# EAGLE design schema (EAGLE 9.5.1)
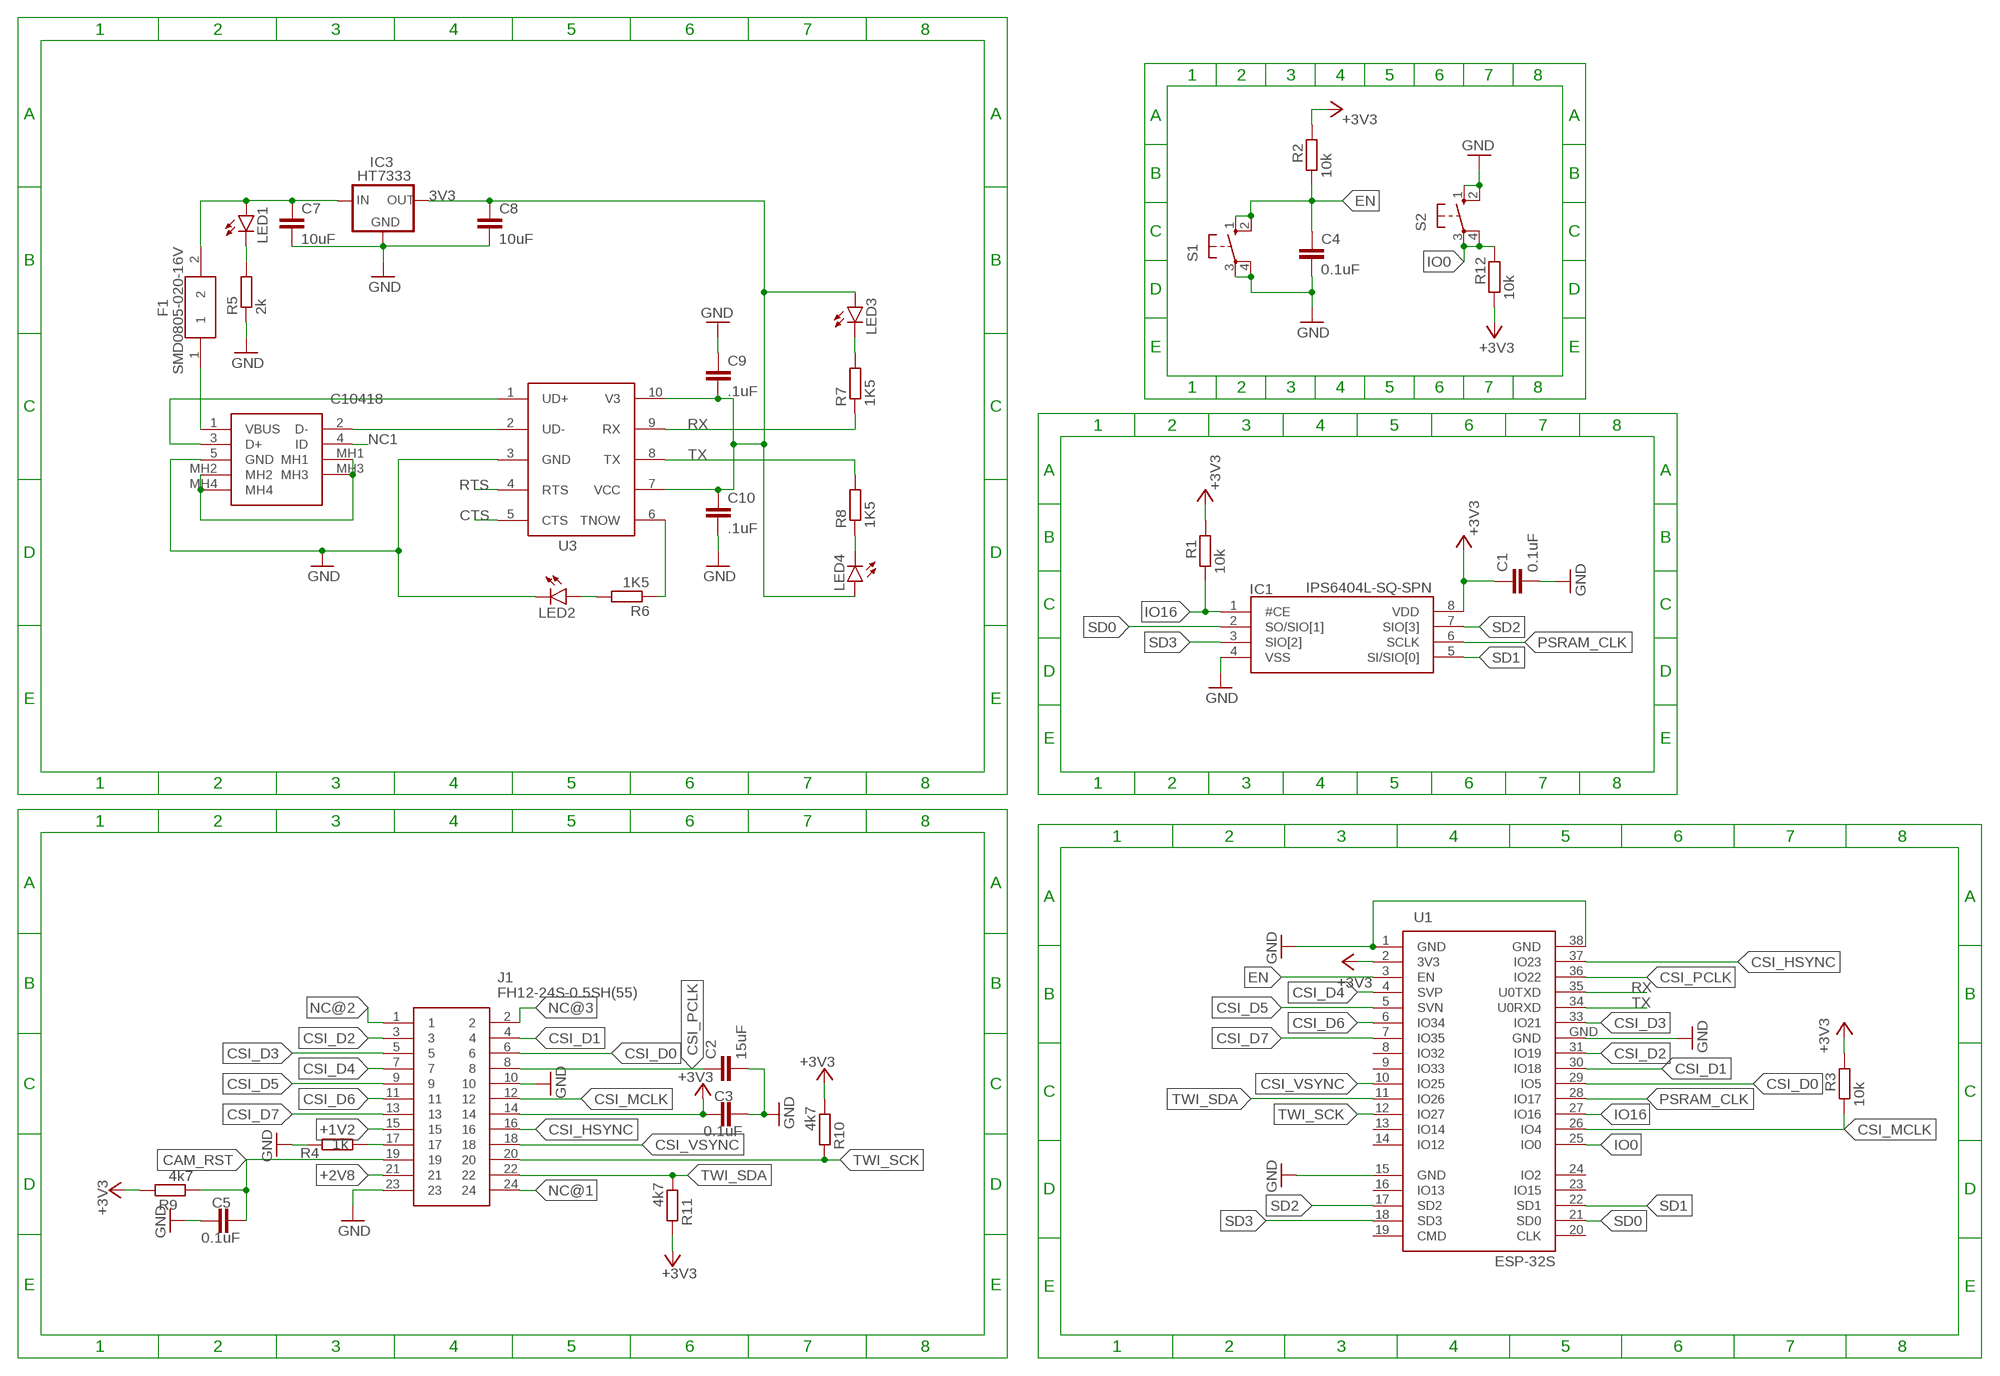
[diagram p0: schematic, sheet 1]

## Parts
C1  0.1uF  C-EUC0805  [C0805]
C2  15uF  C-EUC0805  [C0805]
C3  0.1uF  C-EUC0805  [C0805]
C4  0.1uF  C-EUC0805  [C0805]
C5  0.1uF  C-EUC0805  [C0805]
C7  10uF  C-EUC0805  [C0805]
C8  10uF  C-EUC0805  [C0805]
C9  .1uF  C-EUC0805  [C0805]
C10  .1uF  C-EUC0805  [C0805]
F1  SMD0805-020-16V  [FUSC2114X100N]
IC1  IPS6404L-SQ-SPN  [SOIC127P600X175-8N]
IC3  HT7333  [SOT-89]
J1  FH12-24S-0.5SH(55)  [FH12-24S-0.5SH(55)]
J3  C10418  [C10418]
LED1  LEDCHIP-LED0805  [CHIP-LED0805]
LED2  LEDCHIP-LED0805  [CHIP-LED0805]
LED3  LEDCHIP-LED0805  [CHIP-LED0805]
LED4  LEDCHIP-LED0805  [CHIP-LED0805]
R1  10k  R-EU_R0805  [R0805]
R2  10k  R-EU_R0805  [R0805]
R3  10k  R-EU_R0805  [R0805]
R4  1k  R-EU_R0805  [R0805]
R5  2k  R-EU_R0805  [R0805]
R6  1K5  R-EU_R0805  [R0805]
R7  1K5  R-EU_R0805  [R0805]
R8  1K5  R-EU_R0805  [R0805]
R9  4k7  R-EU_R0805  [R0805]
R10  4k7  R-EU_R0805  [R0805]
R11  4k7  R-EU_R0805  [R0805]
R12  10k  R-EU_R0805  [R0805]
S1  10-XX  [B3F-10XX]
S2  10-XX  [B3F-10XX]
U1  ESP-32S  [ESP-32S]
U3  CH340ESMD  [MSOP10]

## Nets
3V3: C8.1 C9.2 C10.1 IC3.1(OUT) LED3.A LED4.A U3.7(VCC) U3.10(V3)
5V-USB: F1.1 J3.1(VBUS)
+1V2: J1.15
+2V8: J1.21
+3V3: C1.1 C3.1 IC1.8(VDD) J1.14 R1.2 R2.2 R3.2 R9.2 R10.1 R11.2 R12.1 U1.2(3V3)
+5V1: C7.1 F1.2 IC3.3(IN) IC3.4(IN) LED1.A
CAM_RST: C5.2 J1.19 R9.1
CSI_D0: J1.6 U1.29(IO5)
CSI_D1: J1.4 U1.30(IO18)
CSI_D2: J1.3 U1.31(IO19)
CSI_D3: J1.5 U1.33(IO21)
CSI_D4: J1.7 U1.4(SVP)
CSI_D5: J1.9 U1.5(SVN)
CSI_D6: J1.11 U1.6(IO34)
CSI_D7: J1.13 U1.7(IO35)
CSI_HSYNC: J1.16 U1.37(IO23)
CSI_MCLK: J1.12 R3.1 U1.26(IO4)
CSI_PCLK: C2.1 J1.8 U1.36(IO22)
CSI_VSYNC: J1.18 U1.10(IO25)
CTS: U3.5(CTS)
D+1: J3.3(D+) U3.1(UD+)
D-1: J3.2(D-) U3.2(UD-)
EN: C4.1 R2.1 S1.1(S) S1.2(S1) U1.3(EN)
GND: C1.2 C2.2 C3.2 C4.2 C5.1 C7.2 C8.2 C9.1 C10.2 IC1.4(VSS) IC3.2(GND) J1.10 J1.23 J3.5(GND) LED2.C R4.2 R5.1 S1.3(P) S1.4(P1) S2.1(S) S2.2(S1) U1.1(GND) U1.15(GND) U1.38(GND) U1.GND U3.3(GND)
IO0: R12.2 S2.3(P) S2.4(P1) U1.25(IO0)
IO16: IC1.1(#CE) R1.1 U1.27(IO16)
MH: J3.MH1 J3.MH2 J3.MH3 J3.MH4
N$1: J1.17 R4.1
N$7: LED1.C R5.2
N$8: R6.1 U3.6(TNOW)
N$9: LED2.A R6.2
N$12: LED3.C R7.2
N$13: LED4.C R8.1
NC1: J3.4(ID)
NC@1: J1.24
NC@2: J1.1
NC@3: J1.2
PSRAM_CLK: IC1.6(SCLK) U1.28(IO17)
RTS: U3.4(RTS)
RX: R7.1 U1.35(U0TXD) U3.9(RX)
SD0: IC1.2(SO/SIO[1]) U1.21(SD0)
SD1: IC1.5(SI/SIO[0]) U1.22(SD1)
SD2: IC1.7(SIO[3]) U1.17(SD2)
SD3: IC1.3(SIO[2]) U1.18(SD3)
TWI_SCK: J1.20 R10.2 U1.12(IO27)
TWI_SDA: J1.22 R11.1 U1.11(IO26)
TX: R8.2 U1.34(U0RXD) U3.8(TX)
Unconnected: U1.8(IO32) U1.9(IO33) U1.13(IO14) U1.14(IO12) U1.16(IO13) U1.19(CMD) U1.20(CLK) U1.23(IO15) U1.24(IO2)

## Library data of the parts
C1-C5 C7-C10 = rcl:C-EU: CAPACITOR, European symbol; SPICEPREFIX: C
F1 = water-lib:SMD0805-020-16V: PTC Resettable Fuses 0805 RoHS Source: Datasheet <https://datasheet.lcsc.com/szlcsc/TECHFUSE-SMD0805-020-16V_C70057.pdf>; DESCRIPTION: PTC Resettable Fuses 0805 RoHS; HEIGHT: 1mm; MANUFACTURER_NAME: TECHFUSE; MANUFACTURER_PART_NUMBER: SMD0805-020-16V
IC1 = water-lib:IPS6404L-SQ-SPN: int Source: Datasheet <https://github.com/Edragon/Datasheet/blob/master/IPUS/IPUS 64Mbit.pdf>; DESCRIPTION: int; HEIGHT: 1.75mm; MANUFACTURER_NAME: Electrodragon; MANUFACTURER_PART_NUMBER: IPS6404L-SQ-SPN
IC3 = water-lib:HT73*
J1 = water-lib:FH12-24S-0.5SH(55): HIROSE(HRS) - FH12-24S-0.5SH(55) - SOCKET FFC/FPC, ZIF, 0.5MM, 24WAY Source: Datasheet <https://www.hirose.com/product/en/download_file/key_name/FH12-18S-0.5SH(55)/category/Drawing (2D)/doc_file_id/75611/?file_category_id=6&item_id=05860530155&is_series=>; DESCRIPTION: HIROSE(HRS) - FH12-24S-0.5SH(55) - SOCKET FFC/FPC, ZIF, 0.5MM, 24WAY; HEIGHT: mm; MANUFACTURER_NAME: Hirose; MANUFACTURER_PART_NUMBER: FH12-24S-0.5SH(55); MOUSER_PART_NUMBER: 798-FH12-24S-0.5SH55; MOUSER_PRICE-STOCK: https://www.mouser.com/Search/Refine.aspx?Keyword=798-FH12-24S-0.5SH55; RS_PART_NUMBER: 7388827P; RS_PRICE-STOCK: http://uk.rs-online.com/web/p/products/7388827P
J3 = water-lib:C10418: USB Connectors SMD RoHS Source: Datasheet <https://datasheet.lcsc.com/szlcsc/Jing-Extension-of-the-Electronic-Co-LCSC-MICRO-USB-5S-B-Type-horns-High-temperature_C10418.pdf>; DESCRIPTION: USB Connectors SMD RoHS; HEIGHT: 3.15mm; MANUFACTURER_NAME: Jing Extension of the Electronic Co.; MANUFACTURER_PART_NUMBER: C10418
LED1-LED4 = led:LED: LED OSRAM: - CHIPLED LG R971, LG N971, LY N971, LG Q971, LY Q971, LO R971, LY R971 LH N974, LH R974 LS Q976, LO Q976, LY Q976 LO Q996 - Hyper CHIPLED LW Q18S LB Q993, LB Q99A, LB R99A - SideLED LS A670, LO A670, LY A670, LG A670, LP A670 LB A673, LV A673, LT A673, LW A673 LH A674 LY A675 LS A676, LA A676, LO A676, LY A676, LW A676 LS A679, LY A679, LG A679 - Hyper Micro SIDELED® LS Y876, LA Y876, LO Y876, LY Y876 LT Y87S - SmartLED LW L88C, LW L88S LB L89C, LB L89S, LG L890 LS L89K, LO L89K, LY L89K LS L896, LA L896, LO L896, LY L896 - TOPLED LS T670, LO T670, LY T670, LG T670, LP T670 LSG T670, LSP T670, LSY T670, LOP T670, LYG T670 LG T671, LOG T671, LSG T671 LB T673, LV T673, LT T673, LW T673 LH T674 LS T676, LA T676, LO T676, LY T676, LB T676, LH T676, LSB T676, LW T676 LB T67C, LV T67C, LT T67C, LS T67K, LO T67K, LY T67K, LW E67C LS E67B, LA E67B, LO E67B, LY E67B, LB E67C, LV E67C, LT E67C LW T67C LS T679, LY T679, LG T679 LS T770, LO T770, LY T770, LG T770, LP T770 LB T773, LV T773, LT T773, LW T773 LH T774 LS E675, LA E675, LY E675, LS T675 LS T776, LA T776, LO T776, LY T776, LB T776 LHGB T686 LT T68C, LB T68C - Hyper Mini TOPLED® LB M676 - Mini TOPLED Santana® LG M470 LS M47K, LO M47K, LY M47K Source: http://www.osram.convergy.de LUXEON: - LUMILED® LXK2-PW12-R00, LXK2-PW12-S00, LXK2-PW14-U00, LXK2-PW14-V00 LXK2-PM12-R00, LXK2-PM12-S00, LXK2-PM14-U00 LXK2-PE12-Q00, LXK2-PE12-R00, LXK2-PE12-S00, LXK2-PE14-T00, LXK2-PE14-U00 LXK2-PB12-K00, LXK2-PB12-L00, LXK2-PB12-M00, LXK2-PB14-N00, LXK2-PB14-P00, LXK2-PB14-Q00 LXK2-PR12-L00, LXK2-PR12-M00, LXK2-PR14-Q00, LXK2-PR14-R00 LXK2-PD12-Q00, LXK2-PD12-R00, LXK2-PD12-S00 LXK2-PH12-R00, LXK2-PH12-S00 LXK2-PL12-P00, LXK2-PL12-Q00, LXK2-PL12-R00 Source: www.luxeon.com KINGBRIGHT: KA-3528ASYC Source: www.kingbright.com
R1-R12 = rcl:R-EU_: RESISTOR, European symbol; SPICEPREFIX: R
S1 S2 = switch-omron:10-XX: OMRON SWITCH; MPN: B3F-1000; OC_FARNELL: 176432; OC_NEWARK: 36M3542
U1 = water-lib:ESP-32S: Ai-Thinker ESP-32S
U3 = water-lib:CH340E: WCH.CN/CH340E See DataSheet： wch.cn <http://www.wch.cn/downloads/CH340DS1_PDF.html>

## Board
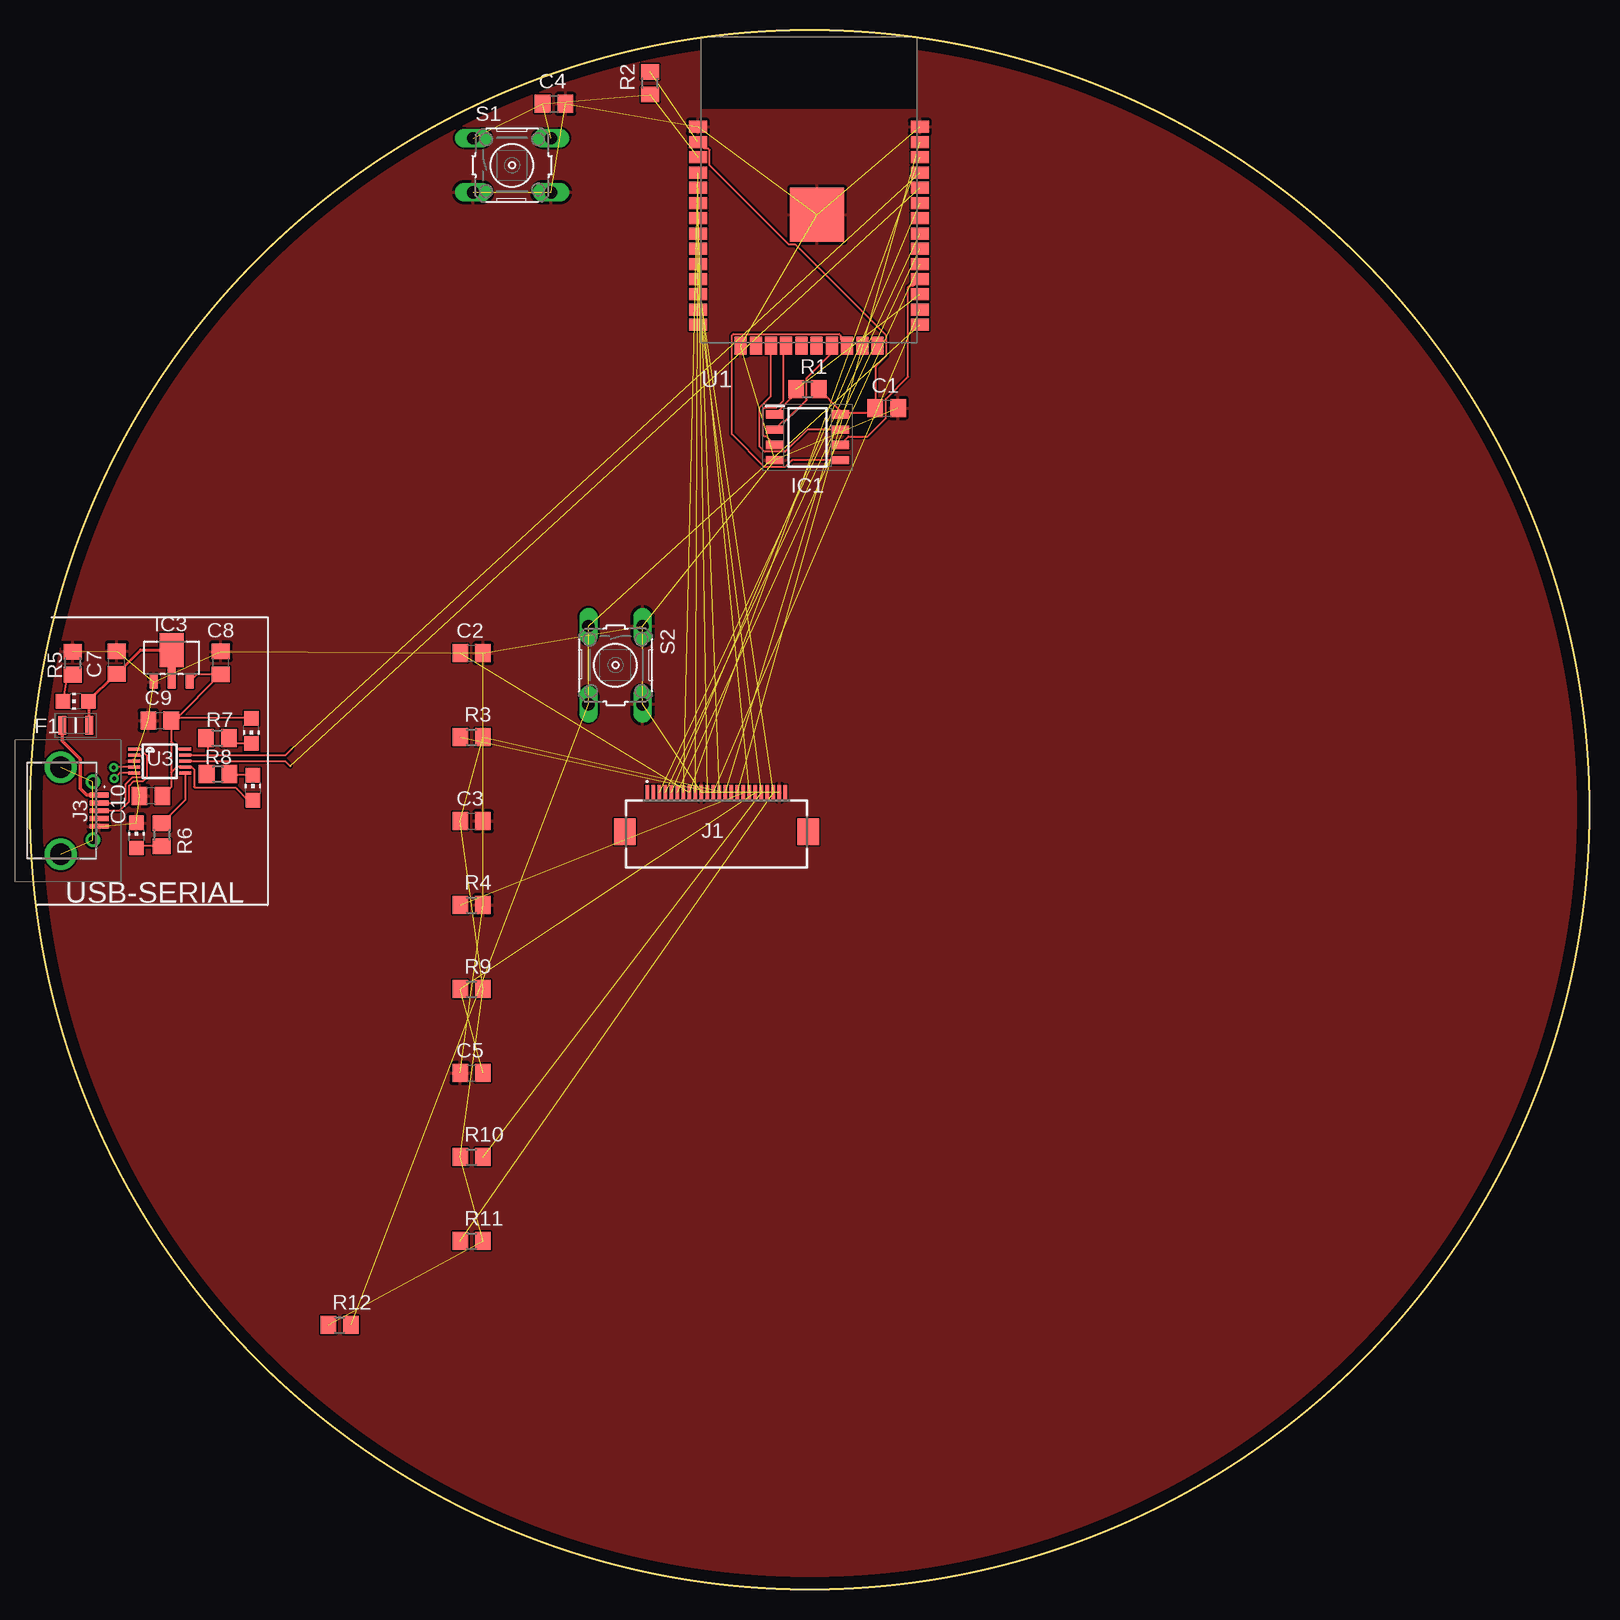
[diagram p1: board, top side]

Size 130 x 130 mm. Coordinates in mm from the lower left corner, seen from the top.
Outline: circle at 65,65 radius 65
Copper layers (1*16): Top 0.035mm / dielectric 1.5mm / Bottom 0.035mm
Design rules "default": minimum track width 6mil, minimum drill 0.35mm, track to track 6mil, track to pad 6mil, pad to pad 6mil, via to via 6mil, smd to smd 6mil, copper to edge 40mil, drill to drill 6mil, minimum pad ring 10mil, minimum via ring 8mil, stop-mask expansion 4mil, vias tented up to drill 0mil, thermal gap 10mil

### Footprints (pad centres in the part's own frame; a part is rotated, then mirrored left to right if it is on the bottom)
C0805 = smd 1.3 x 1.5: 1 -0.95,0; 2 0.95,0
FUSC2114X100N = smd 0.68 x 1.52: 1 -1.125,0; 2 1.125,0
SOIC127P600X175-8N = smd 1.525 x 0.7: 1 -2.712,1.905; 2 -2.712,0.635; 3 -2.712,-0.635; 4 -2.712,-1.905; 5 2.712,-1.905; 6 2.712,-0.635; 7 2.712,0.635; 8 2.712,1.905
SOT-89 = smd 0.7 x 1.1: 1 1.5,-2.385; 2 -1.5,-2.385 | smd 0.7 x 1.8: 3 0,-2.035 | smd 2 x 2.8: 4 0,0.265
FH12-24S-0.5SH(55) = smd 0.3 x 1.3: 1 -5.75,0.65; 2 -5.25,0.65; 3 -4.75,0.65; 4 -4.25,0.65; 5 -3.75,0.65; 6 -3.25,0.65; 7 -2.75,0.65; 8 -2.25,0.65; 9 -1.75,0.65; 10 -1.25,0.65; 11 -0.75,0.65; 12 -0.25,0.65; 13 0.25,0.65; 14 0.75,0.65; 15 1.25,0.65; 16 1.75,0.65; 17 2.25,0.65; 18 2.75,0.65; 19 3.25,0.65; 20 3.75,0.65; 21 4.25,0.65; 22 4.75,0.65; 23 5.25,0.65; 24 5.75,0.65 | smd 1.8 x 2.2: 25 -7.65,-2.6; 26 7.65,-2.6
C10418 = smd 0.4 x 1.6: 1 1.3,-3; 2 0.65,-3; 3 0,-3; 4 -0.65,-3; 5 -1.3,-3 | drill 1.76 pad 2.64: MH1 -3.625,0.2; MH2 3.625,0.2 | drill 0.7 pad 1.2: MH3 -2.425,-2.48; MH4 2.425,-2.48
CHIP-LED0805 = smd 1.2 x 1.2: A 0,-1.05; C 0,1.05
R0805 = smd 1.3 x 1.5: 1 -0.95,0; 2 0.95,0
B3F-10XX = drill 1.016 long: 1 -3.251,2.261; 2 3.251,2.261; 3 -3.251,-2.261; 4 3.251,-2.261
ESP-32S = smd 1.5 x 1: 1 -9.25,7; 2 -9.25,5.73; 3 -9.25,4.46; 4 -9.25,3.19; 5 -9.25,1.92; 6 -9.25,0.65; 7 -9.25,-0.62; 8 -9.25,-1.89; 9 -9.25,-3.16; 10 -9.25,-4.43; 11 -9.25,-5.7; 12 -9.25,-6.97; 13 -9.25,-8.24; 14 -9.25,-9.51; 25 9.25,-9.51; 26 9.25,-8.24; 27 9.25,-6.97; 28 9.25,-5.7; 29 9.25,-4.43; 30 9.25,-3.16; 31 9.25,-1.89; 32 9.25,-0.62; 33 9.25,0.65; 34 9.25,1.92; 35 9.25,3.19; 36 9.25,4.46; 37 9.25,5.73; 38 9.25,7 | smd 1 x 1.5: 15 -5.7,-11.25; 16 -4.43,-11.25; 17 -3.16,-11.25; 18 -1.89,-11.25; 19 -0.62,-11.25; 20 0.65,-11.25; 21 1.92,-11.25; 22 3.19,-11.25; 23 4.46,-11.25; 24 5.73,-11.25 | smd 4.5 x 4.5: GND 0.68,-0.33
MSOP10 = smd 1 x 0.25: 1 -2.113,1; 2 -2.113,0.5; 3 -2.113,0; 4 -2.113,-0.5; 5 -2.113,-1; 6 2.113,-1; 7 2.113,-0.5; 8 2.113,0; 9 2.113,0.5; 10 2.113,1

### Placement (x,y rotation side)
C1  71.42,98.48 0 top
C2  36.81,78.05 0 top
C3  36.81,64.05 0 top
C4  43.68,123.85 0 top
C5  36.81,43.05 0 top
C7  7.23,77.27 90 top
C8  15.91,77.25 90 top
C9  10.82,72.44 0 top
C10  10.08,66.15 180 top
F1  3.81,72.05 0 top
IC1  64.81,96.05 0 top
IC3  11.81,78.05 0 top
J1  57.22,65.77 0 top
J3  2.76,64.92 90 top
LED1  3.81,74.05 90 top
LED2  8.87,62.86 0 top
LED3  18.45,71.59 180 top
LED4  18.57,66.83 0 top
R1  64.81,100.05 0 top
R2  51.69,125.56 90 top
R3  36.81,71.05 0 top
R4  36.81,57.05 0 top
R5  3.55,77.22 270 top
R6  10.97,62.91 270 top
R7  15.62,70.97 0 top
R8  15.68,67.96 180 top
R9  36.81,50.05 0 top
R10  36.81,36.05 0 top
R11  36.81,29.05 0 top
R12  25.81,22.05 0 top
S1  40.18,118.72 0 top
S2  48.81,77.05 270 top
U1  64.93,114.93 0 top
U3  10.81,69.05 0 top

### Tracks (layer width: path | path; a pad name or v marks a point on that pad's centre or on a via)
3V3
  Top 0.152: IC3.1 13.95,76.3 C8.1 12.05,72.44 C9.2 | C9.2 11.77,70.67 | 11.77,70.67 11.77,68.11 | 11.77,68.11 11.77,66.89 C10.1 | U3.10 12.39,70.05 11.77,70.67 | 11.77,68.11 12.21,68.55 U3.7 13.47,68.55 13.48,68.56 13.68,68.36 13.68,66.91 13.75,66.84 17.13,66.84 18.19,65.78 LED4.A | LED3.A 11.97,72.64 C9.2
5V-USB
  Top 0.305: J3.1 4.72,66.22 4.19,66.75 4.19,69.22 2.69,70.72 F1.1
+3V3  (8 unrouted)
  Top 0.152: 55.65,120.69 U1.2 56.22,120.12 56.53,120.12 56.66,119.98 56.66,118.73 63.27,112.12 63.79,112.12 71.39,104.52 71.39,102.83 70.47,101.92 C1.1 70.04,98.05 67.52,98.05 | R1.2 67.52,98.29 67.52,98.05 | 67.52,98.05 IC1.8
+5V1
  Top 0.254: F1.2 4.94,73.97 LED1.A 7.13,76.32 C7.1 9.23,78.31 IC3.4
  Top 0.305: IC3.4 IC3.3
CAM_RST  (2 unrouted)
CSI_D0  (1 unrouted)
CSI_D1  (1 unrouted)
CSI_D2  (1 unrouted)
CSI_D3  (1 unrouted)
CSI_D4  (1 unrouted)
CSI_D5  (1 unrouted)
CSI_D6  (1 unrouted)
CSI_D7  (1 unrouted)
CSI_HSYNC  (1 unrouted)
CSI_MCLK  (2 unrouted)
CSI_PCLK  (2 unrouted)
CSI_VSYNC  (1 unrouted)
CTS  (via drill 0.35)
  Top 0.152: U3.5 7.46,68.05 v7.02,67.6
D+1
  Top 0.152: U3.1 9.22,70.05 9.73,69.54 9.73,67.7 9.42,67.39 8.65,67.39 8.25,67 8.25,65.7 7.47,64.92 J3.3
D-1
  Top 0.152: J3.2 5.79,65.54 7.66,65.54 7.95,65.83 7.95,67.12 8.52,67.7 9.29,67.7 9.43,67.83 9.43,69.27 9.15,69.55 U3.2
EN  (4 unrouted)
GND  (25 unrouted)
  pour Top: -6.19,132.05 132.81,132.05 132.81,-4.95 -7.18,-4.95 -6.19,62.05
IO0  (3 unrouted)
IO16  (1 unrouted)
  Top 0.152: IC1.1 63.86,99.72 R1.1
MH  (3 unrouted)
N$1  (1 unrouted)
N$7
  Top 0.152: LED1.C 3.07,75.79 R5.2
N$8
  Top 0.152: U3.6 12.92,65.81 R6.1
N$9
  Top 0.152: R6.2 9.02,61.96 LED2.A
N$12
  Top 0.152: LED3.C 17,70.54 R7.2
N$13
  Top 0.152: LED4.C 16.71,67.88 R8.1
PSRAM_CLK
  Top 0.152: IC1.6 68.21,96.11 69.82,96.11 71.35,97.63 71.35,99.24 73.2,101.09 73.2,108.55 73.34,108.69 73.64,108.69 U1.28
RTS  (via drill 0.35)
  Top 0.152: U3.4 7.03,68.55 v6.99,68.51
RX  (1 unrouted)
  Top 0.152: U3.9 14.81,69.55 | 14.81,69.55 21.31,69.55 21.81,70.05 | R7.1 14.81,70.83 14.81,69.55
SD0
  Top 0.152: IC1.2 62.79,97.38 62.96,97.38 64.74,99.16 64.74,100.98 66.85,103.09 U1.21
SD1
  Top 0.152: U1.22 67.58,104.22 67.58,104.52 67.45,104.66 58.64,104.66 58.5,104.52 58.5,96.31 61.24,93.57 62.96,93.57 63.53,94.14 IC1.5
SD2
  Top 0.152: U1.17 61.77,99.49 60.8,98.53 60.8,95.27 61.24,94.84 62.96,94.84 64.8,96.69 IC1.7
SD3
  Top 0.152: IC1.3 61.41,96.11 61.24,96.11 61.11,96.24 61.11,98.4 61.24,98.53 62.25,98.53 62.81,99.1 62.81,103.45 U1.18
TWI_SCK  (2 unrouted)
TWI_SDA  (2 unrouted)
TX  (1 unrouted)
  Top 0.152: U3.8 14.81,69.05 | 14.81,69.05 21.29,69.05 21.7,68.64 | 14.81,69.05 14.81,68.04 R8.2

### Text on the board
tNames: USB-SERIAL